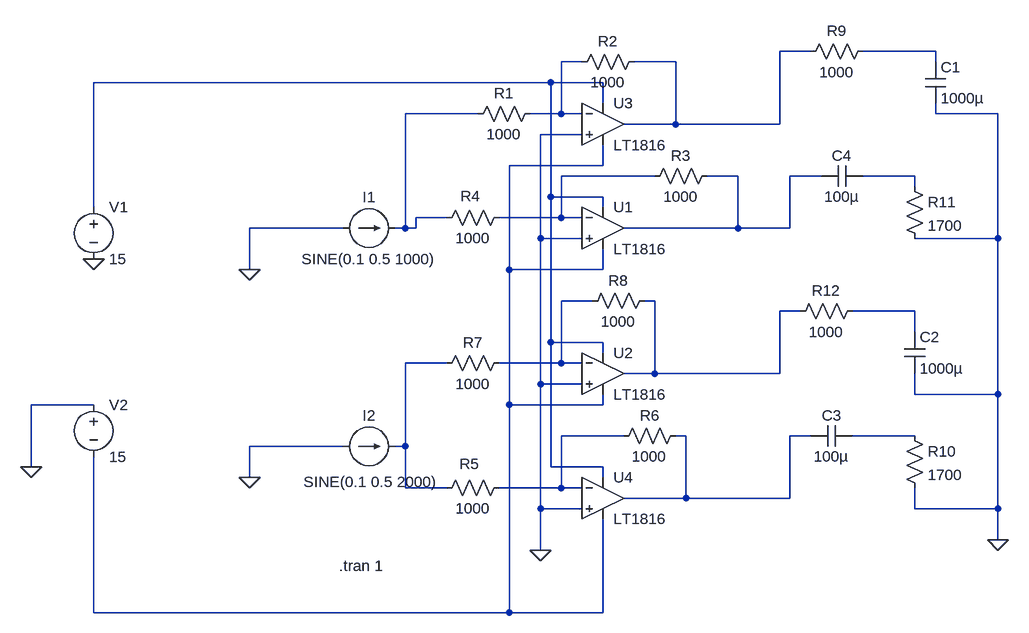
[diagram p0: schematic Sto2.asc]
Sto2.asc, the LTspice schematic file:
Version 4
SHEET 1 996 768
WIRE 688 -176 640 -176
WIRE 880 -176 768 -176
WIRE 336 -160 304 -160
WIRE 480 -160 416 -160
WIRE 880 -160 880 -176
WIRE 288 -128 -416 -128
WIRE 368 -128 288 -128
WIRE 368 -96 368 -128
WIRE 176 -80 64 -80
WIRE 304 -80 304 -160
WIRE 304 -80 256 -80
WIRE 336 -80 304 -80
WIRE 880 -80 880 -96
WIRE 976 -80 880 -80
WIRE 480 -64 480 -160
WIRE 480 -64 400 -64
WIRE 640 -64 640 -176
WIRE 640 -64 480 -64
WIRE 336 -48 272 -48
WIRE 368 0 368 -32
WIRE 368 0 224 0
WIRE 448 16 304 16
WIRE 576 16 528 16
WIRE 704 16 656 16
WIRE 848 16 768 16
WIRE 848 32 848 16
WIRE 288 48 288 -128
WIRE 368 48 288 48
WIRE -416 64 -416 -128
WIRE 368 64 368 48
WIRE 128 80 80 80
WIRE 304 80 304 16
WIRE 304 80 208 80
WIRE 336 80 304 80
WIRE -32 96 -176 96
WIRE 64 96 64 -80
WIRE 64 96 48 96
WIRE 80 96 80 80
WIRE 80 96 64 96
WIRE 576 96 576 16
WIRE 576 96 400 96
WIRE 656 96 656 16
WIRE 656 96 576 96
WIRE 272 112 272 -48
WIRE 336 112 272 112
WIRE 976 112 976 -80
WIRE 976 112 848 112
WIRE -176 160 -176 96
WIRE 224 160 224 0
WIRE 368 160 368 128
WIRE 368 160 224 160
WIRE 352 208 304 208
WIRE 448 208 432 208
WIRE 672 224 640 224
WIRE 848 224 752 224
WIRE 848 256 848 224
WIRE 288 272 288 48
WIRE 368 272 288 272
WIRE 368 288 368 272
WIRE 128 304 64 304
WIRE 304 304 304 208
WIRE 304 304 208 304
WIRE 336 304 304 304
WIRE 448 320 448 208
WIRE 448 320 400 320
WIRE 640 320 640 224
WIRE 640 320 448 320
WIRE 272 336 272 112
WIRE 336 336 272 336
WIRE 848 352 848 320
WIRE 976 352 976 112
WIRE 976 352 848 352
WIRE -416 368 -512 368
WIRE 224 368 224 160
WIRE 368 368 368 352
WIRE 368 368 224 368
WIRE 400 416 304 416
WIRE 496 416 480 416
WIRE 688 416 656 416
WIRE 848 416 752 416
WIRE -32 432 -176 432
WIRE 64 432 64 304
WIRE 64 432 48 432
WIRE -512 464 -512 368
WIRE 288 464 288 272
WIRE 368 464 288 464
WIRE -176 480 -176 432
WIRE 368 480 368 464
WIRE 64 496 64 432
WIRE 128 496 64 496
WIRE 304 496 304 416
WIRE 304 496 208 496
WIRE 336 496 304 496
WIRE 496 512 496 416
WIRE 496 512 400 512
WIRE 656 512 656 416
WIRE 656 512 496 512
WIRE 272 528 272 336
WIRE 336 528 272 528
WIRE 848 528 848 496
WIRE 976 528 976 352
WIRE 976 528 848 528
WIRE 976 576 976 528
WIRE 272 592 272 528
WIRE -416 688 -416 448
WIRE 224 688 224 368
WIRE 224 688 -416 688
WIRE 368 688 368 544
WIRE 368 688 224 688
FLAG 272 592 0
FLAG 976 576 0
FLAG -416 144 0
FLAG -512 464 0
FLAG -176 160 0
FLAG -176 480 0
SYMBOL current -32 96 R270
WINDOW 0 32 40 VTop 2
WINDOW 3 -32 40 VBottom 2
WINDOW 123 0 0 Left 0
WINDOW 39 0 0 Left 0
SYMATTR InstName I1
SYMATTR Value SINE(0.1 0.5 1000)
SYMBOL current -32 432 R270
WINDOW 0 32 40 VTop 2
WINDOW 3 -39 43 VBottom 2
WINDOW 123 0 0 Left 0
WINDOW 39 0 0 Left 0
SYMATTR InstName I2
SYMATTR Value SINE(0.1 0.5 2000)
SYMBOL OpAmps\\LT1816 368 96 R0
SYMATTR InstName U1
SYMBOL OpAmps\\LT1816 368 320 R0
SYMATTR InstName U2
SYMBOL OpAmps\\LT1816 368 -64 R0
SYMATTR InstName U3
SYMBOL OpAmps\\LT1816 368 512 R0
SYMATTR InstName U4
SYMBOL res 160 -64 R270
WINDOW 0 32 56 VTop 2
WINDOW 3 0 56 VBottom 2
SYMATTR InstName R1
SYMATTR Value 1000
SYMBOL res 320 -144 R270
WINDOW 0 32 56 VTop 2
WINDOW 3 0 56 VBottom 2
SYMATTR InstName R2
SYMATTR Value 1000
SYMBOL res 432 32 R270
WINDOW 0 32 56 VTop 2
WINDOW 3 0 56 VBottom 2
SYMATTR InstName R3
SYMATTR Value 1000
SYMBOL res 112 96 R270
WINDOW 0 34 52 VTop 2
WINDOW 3 0 56 VBottom 2
SYMATTR InstName R4
SYMATTR Value 1000
SYMBOL res 112 512 R270
WINDOW 0 37 51 VTop 2
WINDOW 3 0 56 VBottom 2
SYMATTR InstName R5
SYMATTR Value 1000
SYMBOL res 384 432 R270
WINDOW 0 32 56 VTop 2
WINDOW 3 0 56 VBottom 2
SYMATTR InstName R6
SYMATTR Value 1000
SYMBOL res 112 320 R270
WINDOW 0 32 56 VTop 2
WINDOW 3 0 56 VBottom 2
SYMATTR InstName R7
SYMATTR Value 1000
SYMBOL res 336 224 R270
WINDOW 0 32 56 VTop 2
WINDOW 3 0 56 VBottom 2
SYMATTR InstName R8
SYMATTR Value 1000
SYMBOL res 672 -160 R270
WINDOW 0 32 56 VTop 2
WINDOW 3 0 56 VBottom 2
SYMATTR InstName R9
SYMATTR Value 1000
SYMBOL res 832 400 R0
SYMATTR InstName R10
SYMATTR Value 1700
SYMBOL res 832 16 R0
SYMATTR InstName R11
SYMATTR Value 1700
SYMBOL res 768 208 R90
WINDOW 0 0 56 VBottom 2
WINDOW 3 32 56 VTop 2
SYMATTR InstName R12
SYMATTR Value 1000
SYMBOL cap 864 -160 R0
SYMATTR InstName C1
SYMATTR Value 1000µ
SYMBOL cap 832 256 R0
SYMATTR InstName C2
SYMATTR Value 1000µ
SYMBOL cap 752 400 R90
WINDOW 0 0 32 VBottom 2
WINDOW 3 32 32 VTop 2
SYMATTR InstName C3
SYMATTR Value 100µ
SYMBOL cap 768 0 R90
WINDOW 0 0 32 VBottom 2
WINDOW 3 32 32 VTop 2
SYMATTR InstName C4
SYMATTR Value 100µ
SYMBOL voltage -416 48 R0
WINDOW 123 0 0 Left 0
WINDOW 39 0 0 Left 0
SYMATTR InstName V1
SYMATTR Value 15
SYMBOL voltage -416 352 R0
SYMATTR InstName V2
SYMATTR Value 15
TEXT -38 616 Left 2 !.tran 1

The netlist it stands for:
* Sto2.asc
I1 0 N005 SINE(0.1 0.5 1000)
I2 0 N013 SINE(0.1 0.5 2000)
* U1: LT1816 (symbol OpAmps\LT1816 not available, pins judged from their places): In+=0 In-=N007 V+=N004 V-=N006 OUT=N008
* U2: LT1816 (symbol OpAmps\LT1816 not available, pins judged from their places): In+=0 In-=N010 V+=N004 V-=N006 OUT=N011
* U3: LT1816 (symbol OpAmps\LT1816 not available, pins judged from their places): In+=0 In-=N003 V+=N004 V-=N006 OUT=N001
* U4: LT1816 (symbol OpAmps\LT1816 not available, pins judged from their places): In+=0 In-=N014 V+=N004 V-=N006 OUT=N015
R1 N005 N003 1000
R2 N003 N001 1000
R3 N007 N008 1000
R4 N005 N007 1000
R5 N013 N014 1000
R6 N014 N015 1000
R7 N013 N010 1000
R8 N010 N011 1000
R9 N001 N002 1000
R10 N016 0 1700
R11 N009 0 1700
R12 N012 N011 1000
C1 N002 0 1000µ
C2 N012 0 1000µ
C3 N016 N015 100µ
C4 N009 N008 100µ
V1 N004 0 15
V2 0 N006 15
.tran 1
.backanno
.end